# Altium schematic sheet BARRAMENTO.schdoc
size 170 x 93 mm
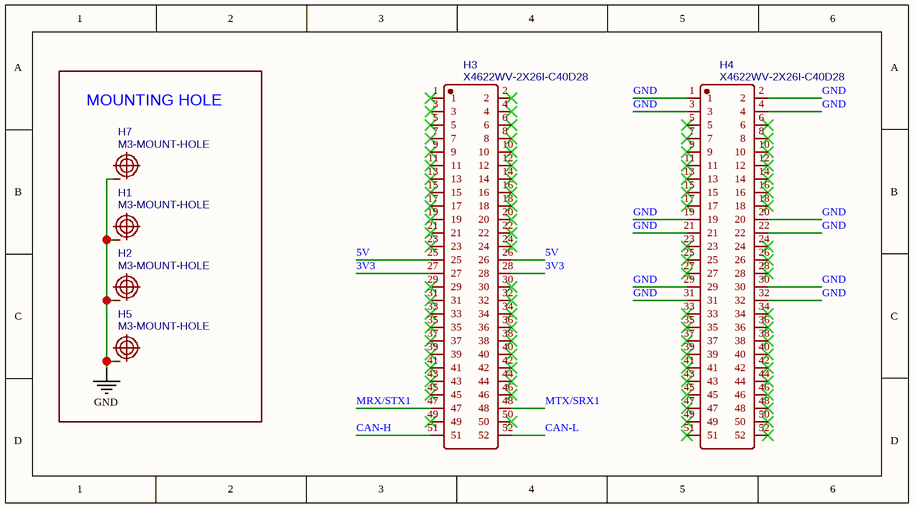
[diagram p0: BARRAMENTO.schdoc]

## Parts
H1  M3-MOUNT-HOLE  [M3-MOUNT-HOLE]
H2  M3-MOUNT-HOLE  [M3-MOUNT-HOLE]
H3  X4622WV-2X26I-C40D28  [HDR-TH_52P-P2.00-V-M-R2-C26-S2.00]
H4  X4622WV-2X26I-C40D28  [HDR-TH_52P-P2.00-V-M-R2-C26-S2.00]
H5  M3-MOUNT-HOLE  [M3-MOUNT-HOLE]
H7  M3-MOUNT-HOLE  [M3-MOUNT-HOLE]

## Blocks framed on the sheet
MOUNTING HOLE: H1 H2 H5 H7

## Nets
GND: H1.1 H2.1 H4.1 H4.2 H4.3 H4.4 H4.19 H4.20 H4.21 H4.22 H4.29 H4.30 H4.31 H4.32 H5.1 H7.1
3V3: H3.27 H3.28
5V: H3.25 H3.26
CAN-H: H3.51
CAN-L: H3.52
MRX/STX1: H3.47
MTX/SRX1: H3.48

Not connected (* = marked no-connect by the designer): H3 1* 2* 3* 4* 5* 6* 7* 8* 9* 10* 11* 12* 13* 14* 15* 16* 17* 18* 19* 20* 21* 22* 23* 24* 29* 30* 31* 32* 33* 34* 35* 36* 37* 38* 39* 40* 41* 42* 43* 44* 45* 46* 49* 50*; H4 5* 6* 7* 8* 9* 10* 11* 12* 13* 14* 15* 16* 17* 18* 23* 24* 25* 26* 27* 28* 33* 34* 35* 36* 37* 38* 39* 40* 41* 42* 43* 44* 45* 46* 47* 48* 49* 50* 51* 52*

## Library data of the parts
H1 H2 H5 H7 = M3-MOUNT-HOLE: Contributor: amugona; spicePre: H; spiceSymbolName: M3-MOUNT-HOLE
H3 H4 = X4622WV-2X26I-C40D28: BOM_Manufacturer: XKB Connectivity(中国星坤); BOM_Manufacturer Part: X1321FV-2x26-C43D24; Contributor: LCSC; BOM_Supplier: LCSC; BOM_Supplier Part: C2881769; link: https://atta.szlcsc.com/upload/public/pdf/source/20211009/BC56471778CEDB5D09E922F3C13F5180.pdf; spicePre: H; spiceSymbolName: X4622WV-2X26I-C40D28